# Altium schematic sheet SHDN-IMD-S03-V00-Shutdown.SchDoc: Shutdown Chain
size A3; Date: 10/07/2020; DrawnBy: Alikhan Hassan; DocumentNumber: 5; Revision: 00; SheetNumber: 5; SheetTotal: 6; Project: IMD Daughter Board 2020; Version: 01
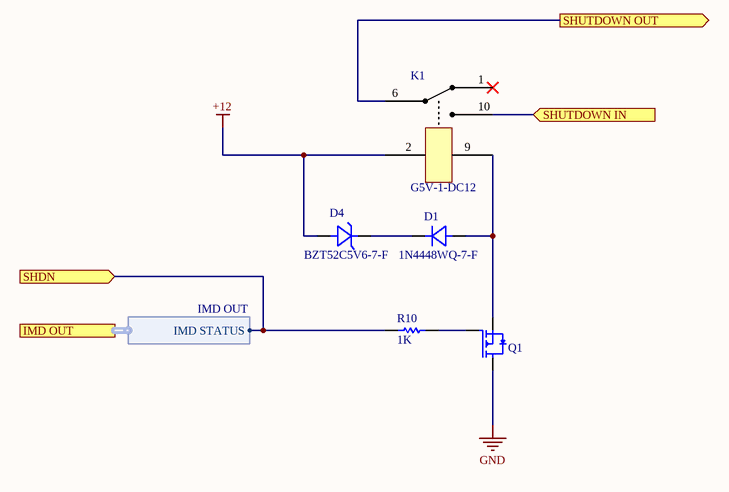
[diagram p0: SHDN-IMD-S03-V00-Shutdown.SchDoc]

## Parts
D1  1N4448WQ-7-F  [SMA]
D4  BZT52C5V6-7-F  [SOD123]
K1  G5V-1-DC12  [G5V-1]
Q1  BST82,215  [PMV15UNEAR]  (value not drawn)
R10  1K  [Res_ThinFilm_0603]

## Ports
IMD OUT (harness IMD OUT), SHDN (in), SHUTDOWN IN (in), SHUTDOWN OUT (out)

## Harnesses
IMD OUT: IMD STATUS

## Nets
+12: D4.A(Anode) K1.2
GND: Q1.D(Drain)
SHDN: R10.1 ; port SHDN, port IMD OUT.IMD STATUS
SHUTDOWN IN: K1.10 ; port SHUTDOWN IN
SHUTDOWN OUT: K1.6 ; port SHUTDOWN OUT
NetD1_A: D1.A(Anode) K1.9 Q1.S(Source)
NetD1_K: D1.K(Cathode) D4.K(Cathode)
NetQ1_G: Q1.G(Gate) R10.2

Not connected (* = marked no-connect by the designer): K1 1*

## Notes on the sheet
- Revision History:
- Sheet Title:
- Rev
- Date
- Description
- Project:
- Size:
- Drawn By:
- A3
- Number:
- Revision:
- Sheet
- Version:
- of
- QUT Motorsport
- O-120, Gardens Point
- 2 George Street
- Brisbane, QLD 4000
- Australia
- Print Date:
- Print Time:
- File Name:

## Library data of the parts
D1 = 1N4448WQ-7-F: Diode, SMD, 75V, 5%, 250mA, SOD123; Manufacturer: ON Semiconductor / Fairchild; Manufacturer Part Number: 1N914BWS; Average Rectified Current: 150mA; Element Configuration: Single; Forward Voltage: 1V; Max Reverse Leakage Current: 5uA; Power Dissipation: 200mW; Recovery Time: 4ns; Max Forward Surge Current (Ifsm): 4A; Parameter 1: *; Weight: 0.0276g; Category: Rectifier Diodes; Contact Plating: Tin,Matte; Forward Current: 150mA; Lead Free: Lead Free; Max Operating Temperature: 150°C; Max Repetitive Reverse Voltage (Vrrm): 75V; Max Reverse Voltage (DC): 75V; Min Operating Temperature: -55°C; Mount: Surface Mount; Number of Pins: 2; Package Quantity: 1; Packaging: Tape and Reel; Peak Reverse Current: 5uA; Radiation Hardening: No; REACH SVHC: No SVHC; Reverse Recovery Time: 4ns; Height: 1mm; Length: 1.8mm; Reverse Voltage: 75V; Width: 1.35mm
D4 = BZT52C5V6-7-F: Diode, SMD, Zender, 5.6V, 7%, 500mW, SOD-123; Manufacturer: Generic; MPN: 1.8V 500mW
K1 = G5V-1-DC12: General Purpose Relay SPDT (1 Form C) Through Hole, 12V, 2A
Q1 = PMV15UNEAR: MOSFET N-CH 100V 190MA SOT-23; Manufacturer: Nexperia
R10 = 1k 5% 0603: Resistor, SMD, 1k, 0.1W, 5%, 0603